# Altium project 7Seg_Project.PrjPcb
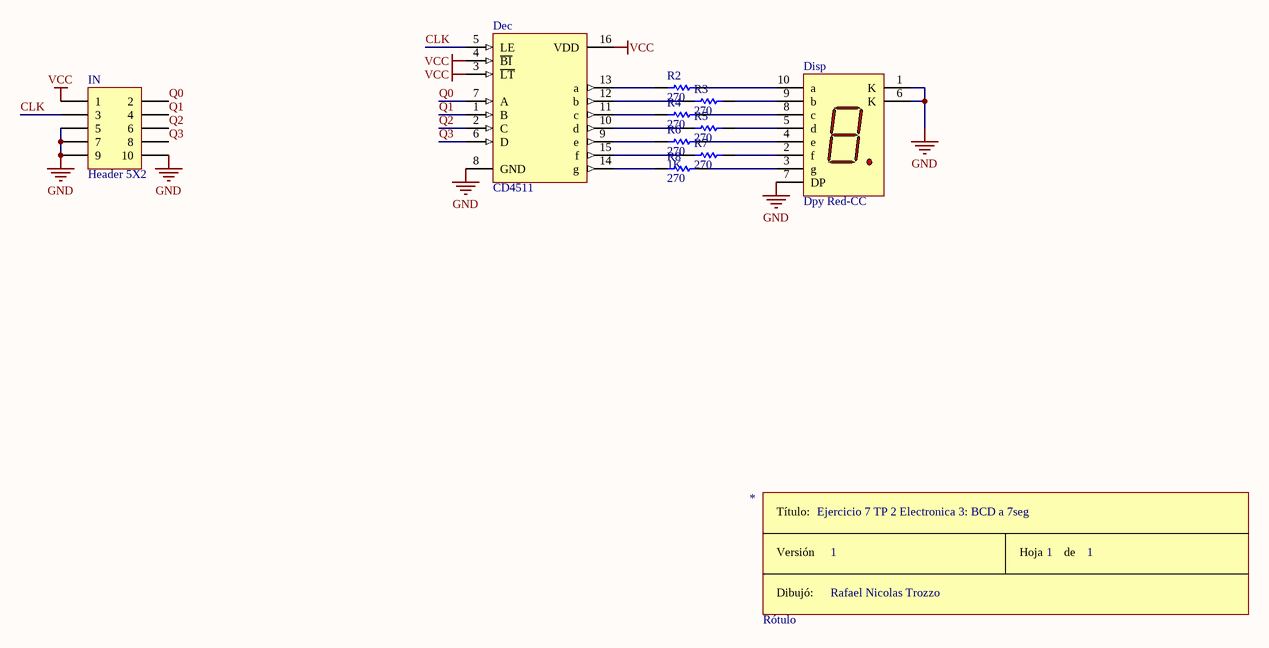
[diagram p0: 7segments.SchDoc]
1 sheet, 11 parts. Net scope: global (net labels, ports and power ports of the same name join across sheets).
Board file: 7segments.PcbDoc

## Sheet 7segments.SchDoc
size A4

### Parts
*  Rótulo
Dec  CD4511  [DIP16]
Disp  Dpy Red-CC  [A]
IN  Header 5X2  [HDR2X5]
R2  270  [AXIAL-0.3]
R3  270  [AXIAL-0.3]
R4  270  [AXIAL-0.3]
R5  270  [AXIAL-0.3]
R6  270  value 1K  [AXIAL-0.3]
R7  270  [AXIAL-0.3]
R8  270  [AXIAL-0.3]

### Nets
GND: Dec.8(GND) Disp.1(K) Disp.6(K) Disp.7(DP) IN.5 IN.7 IN.9 IN.10
VCC: Dec.3(~{LT}) Dec.4(~{BI}) Dec.16(VDD) IN.1
CLK: Dec.5(LE) IN.3
Q0: Dec.7(A) IN.2
Q1: Dec.1(B) IN.4
Q2: Dec.2(C) IN.6
Q3: Dec.6(D) IN.8
NetDec_9: Dec.9(e) R6.1
NetDec_10: Dec.10(d) R5.1
NetDec_11: Dec.11(c) R4.1
NetDec_12: Dec.12(b) R3.1
NetDec_13: Dec.13(a) R2.1
NetDec_14: Dec.14(g) R8.1
NetDec_15: Dec.15(f) R7.1
NetDisp_2: Disp.2(f) R7.2
NetDisp_3: Disp.3(g) R8.2
NetDisp_4: Disp.4(e) R6.2
NetDisp_5: Disp.5(d) R5.2
NetDisp_8: Disp.8(c) R4.2
NetDisp_9: Disp.9(b) R3.2
NetDisp_10: Disp.10(a) R2.2

### Notes on the sheet
- Ejercicio 7 TP 2 Electronica 3: BCD a 7seg
- 1
- Rafael Nicolas Trozzo
- (in symbol Rótulo) Título:; Versión; Hoja       de; Dibujó:

### Library data of the parts
Dec = CD4511: BCD to 7 SEGMENTOS
Disp = Dpy Red-CC: 7.62 mm Black Surface HER 7-Segment Display: CC, RH DP; MinimumIntensity: 360 ucd; Note: IF = 5 mA; Note: Pins 1 and 6 are redundant Cathodes.; Published: 8-Jun-2000; LatestRevisionDate: 17-Dec-2003; LatestRevisionNote: Schematic revised, PCB Footprint replaced.; DatasheetVersion: 19-Feb-2002; PackageVersion: 11-Feb-2002; PackageReference: A; Publisher: Altium Limited; PackageDescription: LED, 7-Segment Display, 7.62 mm, RHD; 10 Leads; Row Space 5.08 mm; Pitch 2.54 mm; Colour: High Efficiency Red (HER); ComponentLink1Description: Manufacturer Link; ComponentLink1URL: http://www.agilent.com/
IN = Header 5X2: Header, 5-Pin, Dual row; LatestRevisionDate: 17-Jul-2002; LatestRevisionNote: Re-released for DXP Platform.; Publisher: Altium Limited
R2-R8 = Res1: Resistor; Published: 8-Jun-2000; LatestRevisionDate: 17-Jul-2002; LatestRevisionNote: Re-released for DXP Platform.; PackageReference: AXIAL-0.3; Publisher: Altium Limited; PackageDescription: Axial Device, Thru-Hole; 2 Leads; 0.3 in Pin Spacing